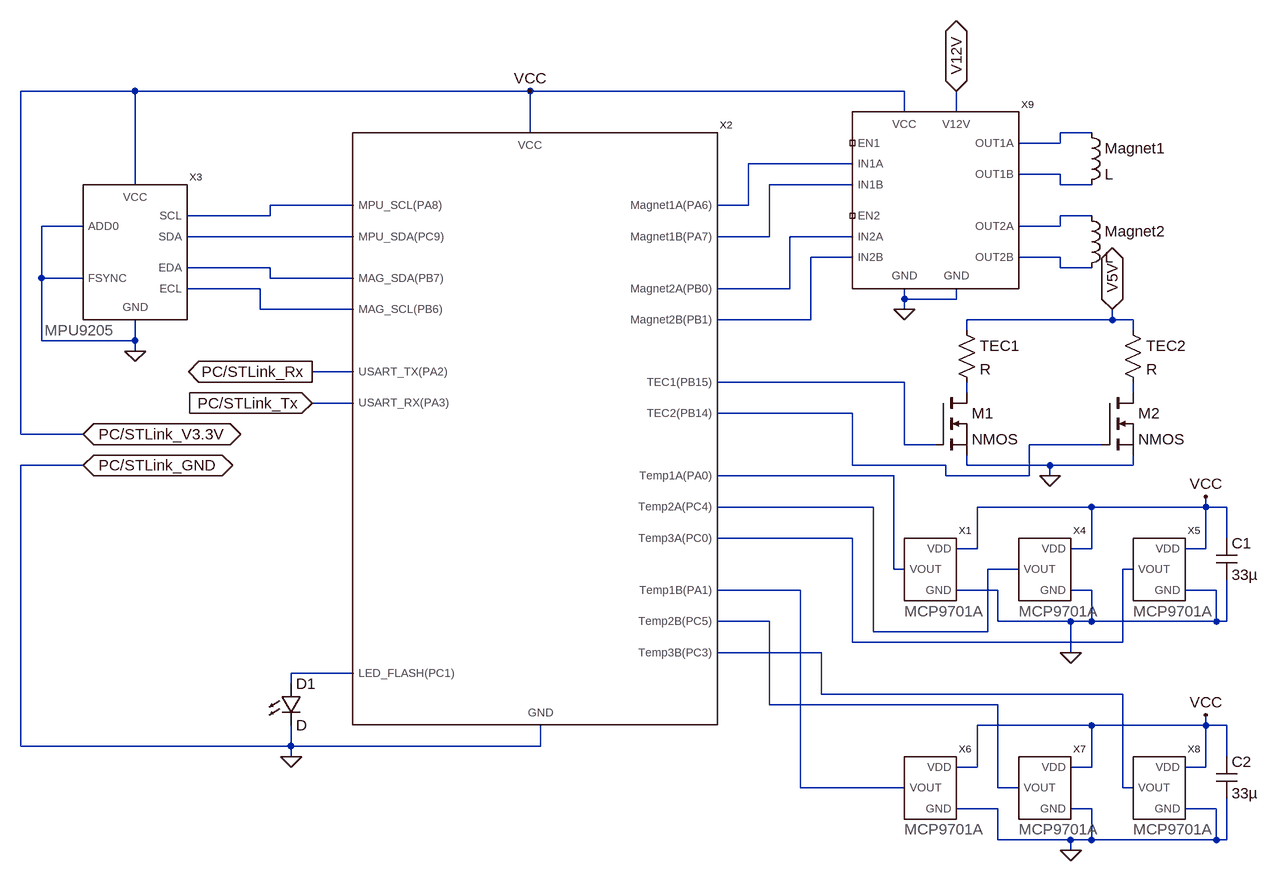
[diagram p0: schematic Main.asc]
Main.asc, the LTspice schematic file:
Version 4
SHEET 1 1228 788
WIRE -1120 -400 -1296 -400
WIRE -512 -400 -1120 -400
WIRE 64 -400 -512 -400
WIRE 64 -368 64 -400
WIRE 144 -368 144 -400
WIRE -512 -336 -512 -400
WIRE 352 -336 304 -336
WIRE 304 -320 304 -336
WIRE 304 -320 240 -320
WIRE -16 -288 -176 -288
WIRE 304 -272 240 -272
WIRE -1120 -256 -1120 -400
WIRE -16 -256 -144 -256
WIRE 304 -256 304 -272
WIRE 352 -256 304 -256
WIRE -784 -224 -912 -224
WIRE -176 -224 -176 -288
WIRE -176 -224 -224 -224
WIRE -912 -208 -912 -224
WIRE -912 -208 -1040 -208
WIRE 352 -208 304 -208
WIRE -1200 -192 -1264 -192
WIRE 304 -192 304 -208
WIRE 304 -192 240 -192
WIRE -784 -176 -1040 -176
WIRE -144 -176 -144 -256
WIRE -144 -176 -224 -176
WIRE -16 -176 -112 -176
WIRE -16 -144 -80 -144
WIRE 304 -144 240 -144
WIRE -912 -128 -1040 -128
WIRE 304 -128 304 -144
WIRE 352 -128 304 -128
WIRE -1264 -112 -1264 -192
WIRE -1200 -112 -1264 -112
WIRE -912 -112 -912 -128
WIRE -784 -112 -912 -112
WIRE -928 -96 -1040 -96
WIRE -112 -96 -112 -176
WIRE -112 -96 -224 -96
WIRE 64 -80 64 -96
WIRE 144 -80 144 -96
WIRE 144 -80 64 -80
WIRE -928 -64 -928 -96
WIRE -784 -64 -928 -64
WIRE 64 -64 64 -80
WIRE -80 -48 -80 -144
WIRE -80 -48 -224 -48
WIRE 384 -48 384 -64
WIRE 384 -48 160 -48
WIRE 416 -48 384 -48
WIRE 160 -32 160 -48
WIRE 416 -32 416 -48
WIRE -1264 -16 -1264 -112
WIRE -1120 -16 -1120 -48
WIRE -1120 -16 -1264 -16
WIRE -1120 0 -1120 -16
WIRE -784 32 -848 32
WIRE 64 48 -224 48
WIRE 160 64 160 48
WIRE 416 64 416 48
WIRE -784 80 -848 80
WIRE -16 96 -224 96
WIRE -1296 128 -1296 -400
WIRE -1200 128 -1296 128
WIRE 64 144 64 48
WIRE 112 144 64 144
WIRE 368 144 256 144
WIRE -1200 176 -1296 176
WIRE -16 176 -16 96
WIRE 128 176 -16 176
WIRE 160 176 160 160
WIRE 288 176 160 176
WIRE 416 176 416 160
WIRE 416 176 288 176
WIRE 48 192 -224 192
WIRE 128 192 128 176
WIRE 256 192 256 144
WIRE 256 192 128 192
WIRE 288 192 288 176
WIRE 16 240 -224 240
WIRE 352 240 176 240
WIRE 528 240 528 224
WIRE 528 240 352 240
WIRE 560 240 528 240
WIRE -16 288 -224 288
WIRE 560 288 560 240
WIRE 176 304 176 240
WIRE 176 304 144 304
WIRE 352 304 352 240
WIRE 352 304 320 304
WIRE 528 304 528 240
WIRE 528 304 496 304
WIRE 48 336 48 192
WIRE 64 336 48 336
WIRE 240 336 192 336
WIRE 416 336 400 336
WIRE -96 368 -224 368
WIRE 208 368 144 368
WIRE 352 368 320 368
WIRE 544 368 496 368
WIRE -144 416 -224 416
WIRE 208 416 208 368
WIRE 320 416 208 416
WIRE 352 416 352 368
WIRE 352 416 320 416
WIRE 544 416 544 368
WIRE 544 416 352 416
WIRE 560 416 560 352
WIRE 560 416 544 416
WIRE 16 432 16 240
WIRE 192 432 192 336
WIRE 192 432 16 432
WIRE -16 448 -16 288
WIRE 400 448 400 336
WIRE 400 448 -16 448
WIRE -64 464 -224 464
WIRE 320 464 320 416
WIRE -784 496 -880 496
WIRE -880 512 -880 496
WIRE -64 528 -64 464
WIRE 400 528 -64 528
WIRE -144 544 -144 416
WIRE 208 544 -144 544
WIRE 352 576 176 576
WIRE 528 576 528 560
WIRE 528 576 352 576
WIRE 560 576 528 576
WIRE -1296 608 -1296 176
WIRE -880 608 -880 576
WIRE -880 608 -1296 608
WIRE -496 608 -496 576
WIRE -496 608 -880 608
WIRE -880 624 -880 608
WIRE 560 624 560 576
WIRE 176 640 176 576
WIRE 176 640 144 640
WIRE 352 640 352 576
WIRE 352 640 320 640
WIRE 528 640 528 576
WIRE 528 640 496 640
WIRE -96 672 -96 368
WIRE 64 672 -96 672
WIRE 208 672 208 544
WIRE 240 672 208 672
WIRE 400 672 400 528
WIRE 416 672 400 672
WIRE 208 704 144 704
WIRE 352 704 320 704
WIRE 544 704 496 704
WIRE 208 752 208 704
WIRE 320 752 208 752
WIRE 352 752 352 704
WIRE 352 752 320 752
WIRE 544 752 544 704
WIRE 544 752 352 752
WIRE 560 752 560 688
WIRE 560 752 544 752
WIRE 320 768 320 752
FLAG -1200 128 PC/STLink_V3.3V
IOPIN -1200 128 BiDir
FLAG -1120 0 0
FLAG 528 224 VCC
FLAG 320 464 0
FLAG 528 560 VCC
FLAG 320 768 0
FLAG 64 -64 0
FLAG 288 192 0
FLAG 144 -400 V12V
IOPIN 144 -400 BiDir
FLAG 384 -64 V5V
IOPIN 384 -64 BiDir
FLAG -848 80 PC/STLink_Tx
IOPIN -848 80 In
FLAG -848 32 PC/STLink_Rx
IOPIN -848 32 Out
FLAG -880 624 0
FLAG -1200 176 PC/STLink_GND
IOPIN -1200 176 BiDir
FLAG -512 -400 VCC
SYMBOL MCP9701A 96 336 R0
SYMATTR InstName X1
SYMBOL MainBoard -800 32 R0
SYMATTR InstName X2
SYMBOL MPU9205 -1040 -208 R0
SYMATTR InstName X3
SYMBOL MCP9701A 272 336 R0
SYMATTR InstName X4
SYMBOL MCP9701A 448 336 R0
SYMATTR InstName X5
SYMBOL MCP9701A 96 672 R0
SYMATTR InstName X6
SYMBOL MCP9701A 272 672 R0
SYMATTR InstName X7
SYMBOL MCP9701A 448 672 R0
SYMATTR InstName X8
SYMBOL MotorDriver 64 -272 R0
SYMATTR InstName X9
SYMBOL ind 336 -352 R0
SYMATTR InstName Magnet1
SYMBOL ind 336 -224 R0
SYMATTR InstName Magnet2
SYMBOL nmos 112 64 R0
SYMATTR InstName M1
SYMBOL res 144 -48 R0
SYMATTR InstName TEC1
SYMBOL nmos 368 64 R0
SYMATTR InstName M2
SYMBOL res 400 -48 R0
SYMATTR InstName TEC2
SYMBOL cap 544 288 R0
SYMATTR InstName C1
SYMATTR Value 33µ
SYMBOL cap 544 624 R0
SYMATTR InstName C2
SYMATTR Value 33µ
SYMBOL LED -896 512 R0
SYMATTR InstName D1

The netlist it stands for:
* Main.asc
XX1 VCC 0 N017 MCP9701A  ; pins VDD GND VOUT
XX2 VCC 0 N005 N007 N002 N004 N008 N009 N013 N016 N017 N020 N018 N021 N019 N022 N023 N012 N011 PC/STLink_Rx PC/STLink_Tx MainBoard  ; pins VCC GND MPU_SCL(PA8) MPU_SDA(PC9) Magnet1A(PA6) Magnet1B(PA7) Magnet2A(PB0) Magnet2B(PB1) TEC1(PB15) TEC2(PB14) Temp1A(PA0) Temp1B(PA1) Temp2A(PC4) Temp2B(PC5) Temp3A(PC0) Temp3B(PC3) LED_FLASH(PC1) MAG_SCL(PB6) MAG_SDA(PB7) USART_TX(PA2) USART_RX(PA3)
XX3 N005 N007 N011 N012 VCC 0 0 0 MPU9205  ; pins SCL SDA EDA ECL VCC GND ADD0 FSYNC
XX4 VCC 0 N018 MCP9701A  ; pins VDD GND VOUT
XX5 VCC 0 N019 MCP9701A  ; pins VDD GND VOUT
XX6 VCC 0 N020 MCP9701A  ; pins VDD GND VOUT
XX7 VCC 0 N021 MCP9701A  ; pins VDD GND VOUT
XX8 VCC 0 N022 MCP9701A  ; pins VDD GND VOUT
XX9 VCC 0 NC_01 N002 N004 NC_02 N008 N009 V12V 0 N001 N003 N006 N010 MotorDriver  ; pins VCC GND EN1 IN1A IN1B EN2 IN2A IN2B V12V GND OUT1A OUT1B OUT2A OUT2B
L§Magnet1 N001 N003 L
L§Magnet2 N006 N010 L
M1 N014 N013 0 0 NMOS
R§TEC1 V5V N014 R
M2 N015 N016 0 0 NMOS
R§TEC2 V5V N015 R
C1 VCC 0 33µ
C2 VCC 0 33µ
D1 N023 0 D
.model D D
.lib standard.dio
.model NMOS NMOS
.model PMOS PMOS
.lib standard.mos
.backanno
.end